# EAGLE schematic Addon-mapleCUx_Raspi-3V3-UART-CC2530-V04-006 (EAGLE 9.3.0)
MAPLE-CUx Large Version
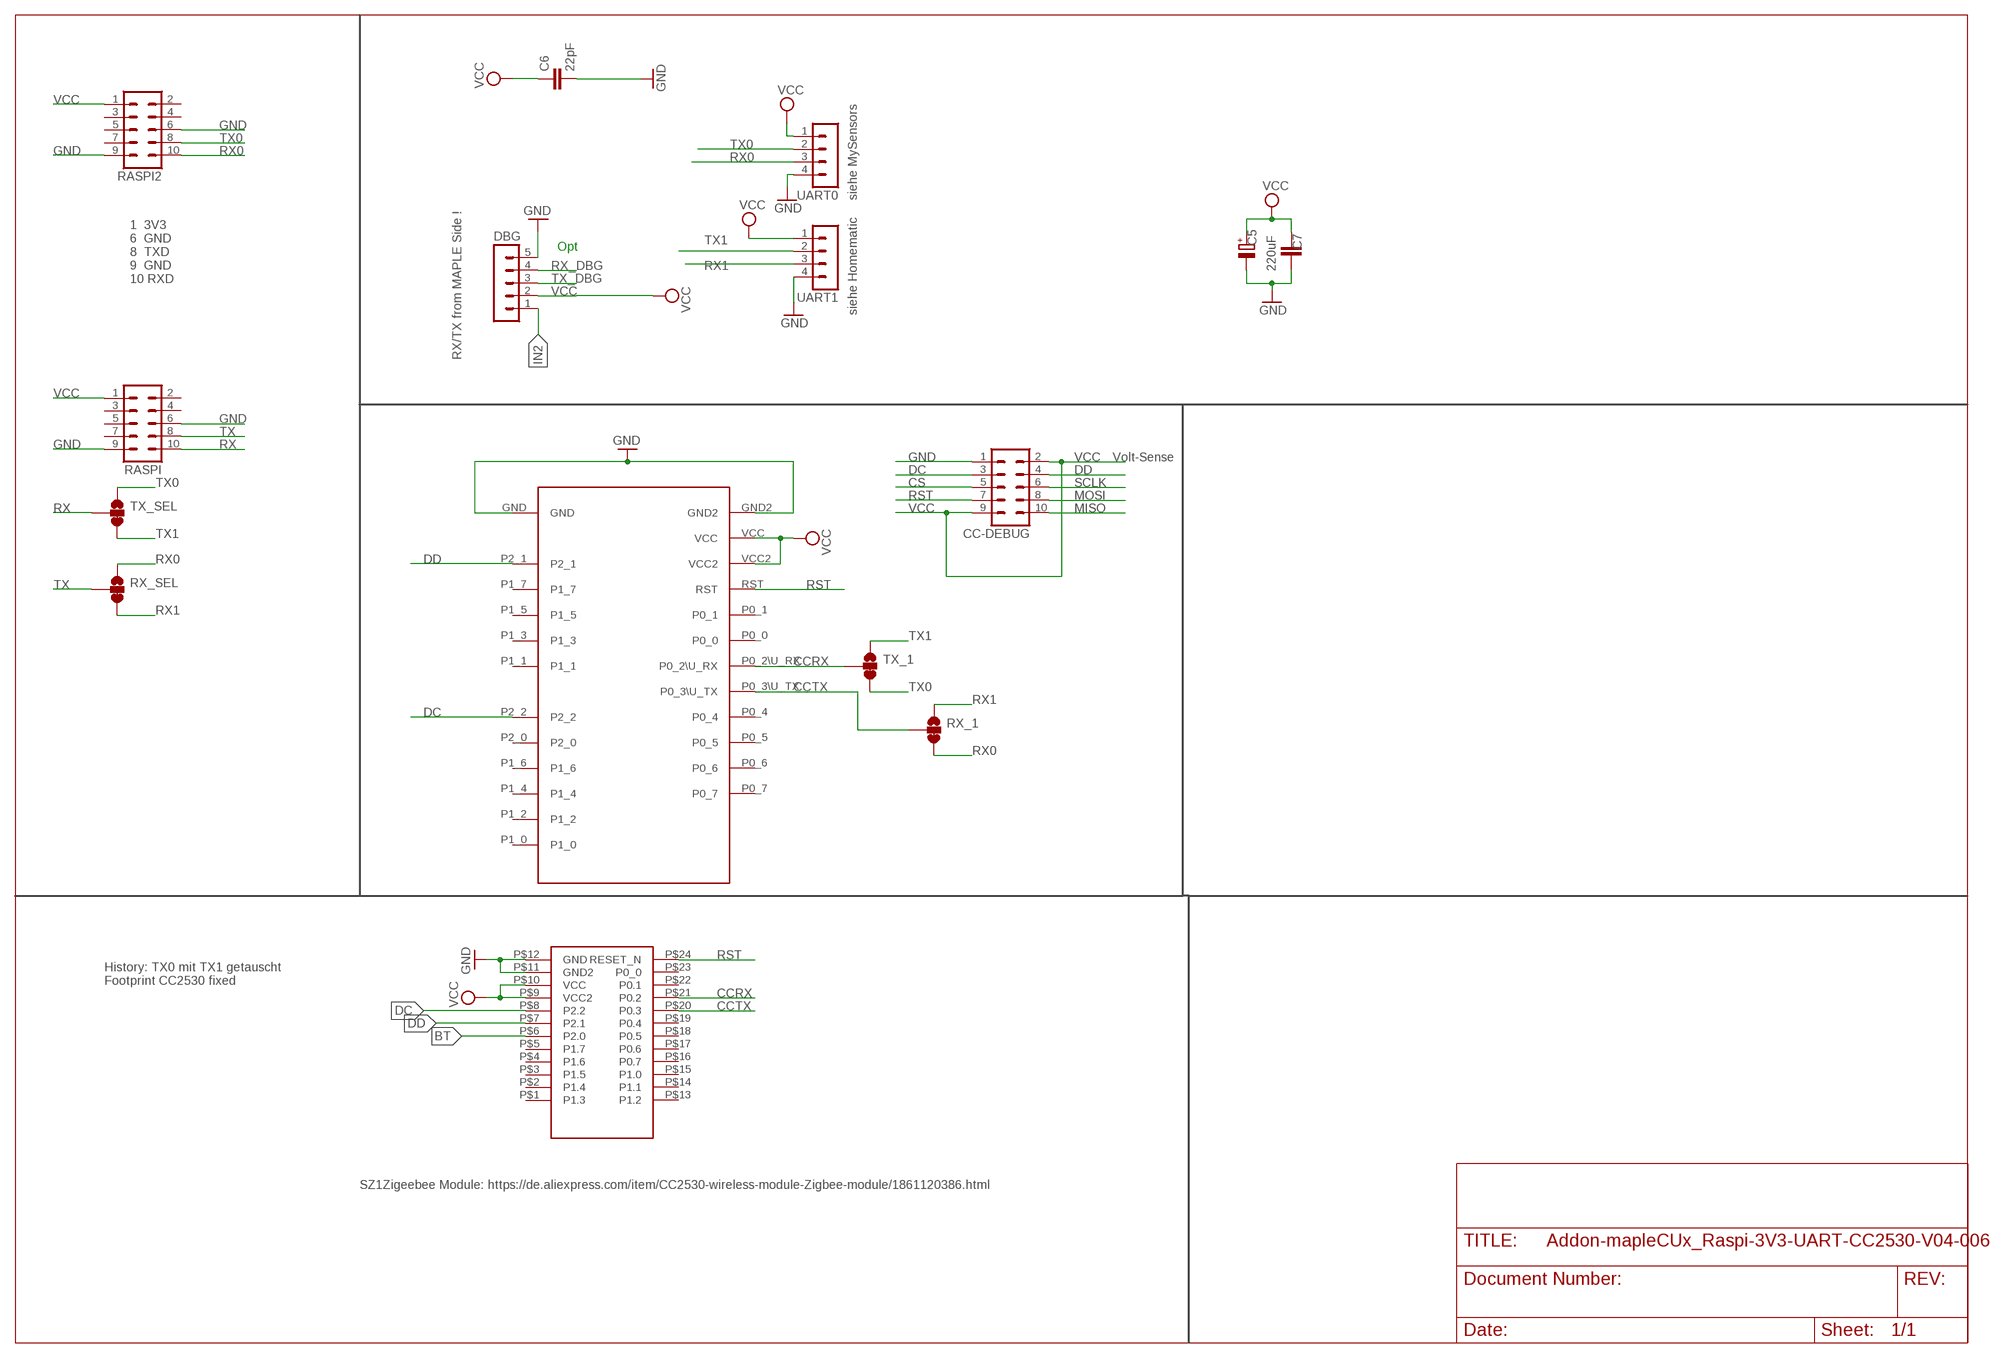
[diagram p0: schematic, sheet 1]

## Parts
C5  220uF  CPOL-EUE5-8.5  [E5-8,5]
C6  22pF  C-EUC0805  [C0805]
C7  C-EUC1812  [C1812]
CC-DEBUG  MA05-2  [MA05-2]
DBG  MA05-1  [MA05-1]
RASPI  MA05-2  [MA05-2]
RASPI2  MA05-2  [MA05-2]
RX_1  JUMPER-SMT_3_1-NC_TRACE_SILK  [SMT-JUMPER_3_1-NC_TRACE_SILK]
RX_SEL  JUMPER-SMT_3_1-NC_TRACE_SILK  [SMT-JUMPER_3_1-NC_TRACE_SILK]
TX_1  JUMPER-SMT_3_1-NC_TRACE_SILK  [SMT-JUMPER_3_1-NC_TRACE_SILK]
TX_SEL  JUMPER-SMT_3_1-NC_TRACE_SILK  [SMT-JUMPER_3_1-NC_TRACE_SILK]
U$1  CC2530CC2530PA  [CC2530PA]
U$3  CC2530_MODULE  [CC2530_DIL]
UART0  MA04-1  [MA04-1]
UART1  MA04-1  [MA04-1]

## Nets
BT: U$1.P$6(P2.0)
CCRX: TX_1.2 U$1.P$21(P0.2) U$3.P0_2\U_RX
CCTX: RX_1.2 U$1.P$20(P0.3) U$3.P0_3\U_TX
CS: CC-DEBUG.5
DC: CC-DEBUG.3 U$1.P$8(P2.2) U$3.P2_2
DD: CC-DEBUG.4 U$1.P$7(P2.1) U$3.P2_1
GND [PWR]: C5.- C6.2 C7.1 CC-DEBUG.1 DBG.5 RASPI2.6 RASPI2.9 RASPI.6 RASPI.9 U$1.P$11(GND2) U$1.P$12(GND) U$3.GND U$3.GND2 UART0.4 UART1.4
IN2 [PWR]: DBG.1
MISO: CC-DEBUG.10
MOSI: CC-DEBUG.8
RST: CC-DEBUG.7 U$1.P$24(RESET_N) U$3.RST
RX: RASPI.10 TX_SEL.2
RX0: RASPI2.10 RX_1.3 RX_SEL.1 UART0.3
RX1: RX_1.1 RX_SEL.3 UART1.3
RX_DBG: DBG.4
SCLK: CC-DEBUG.6
TX: RASPI.8 RX_SEL.2
TX0: RASPI2.8 TX_1.3 TX_SEL.1 UART0.2
TX1: TX_1.1 TX_SEL.3 UART1.2
TX_DBG: DBG.3
VCC [PWR]: C5.+ C6.1 C7.2 CC-DEBUG.2 CC-DEBUG.9 DBG.2 RASPI2.1 RASPI.1 U$1.P$9(VCC2) U$1.P$10(VCC) U$3.VCC U$3.VCC2 UART0.1 UART1.1
Unconnected: RASPI2.2 RASPI2.3 RASPI2.4 RASPI2.5 RASPI2.7 RASPI.2 RASPI.3 RASPI.4 RASPI.5 RASPI.7 U$1.P$1(P1.3) U$1.P$2(P1.4) U$1.P$3(P1.5) U$1.P$4(P1.6) U$1.P$5(P1.7) U$1.P$13(P1.2) U$1.P$14(P1.1) U$1.P$15(P1.0) U$1.P$16(P0.7) U$1.P$17(P0.6) U$1.P$18(P0.5) U$1.P$19(P0.4) U$1.P$22(P0.1) U$1.P$23(P0_0) U$3.P0_0 U$3.P0_1 U$3.P0_4 U$3.P0_5 U$3.P0_6 U$3.P0_7 U$3.P1_0 U$3.P1_1 U$3.P1_2 U$3.P1_3 U$3.P1_4 U$3.P1_5 U$3.P1_6 U$3.P1_7 U$3.P2_0

## Notes on the sheet
- siehe MySensors
- Opt
- 1  3V3
  6  GND
  8  TXD
  9  GND
  10 RXD
- siehe Homematic
- RX/TX from MAPLE Side !
- Volt-Sense
- History: TX0 mit TX1 getauscht
  Footprint CC2530 fixed
- SZ1Zigeebee Module: https://de.aliexpress.com/item/CC2530-wireless-module-Zigbee-module/1861120386.html

## Library data of the parts
C5 = rcl:CPOL-EU: POLARIZED CAPACITOR, European symbol; SPICEPREFIX: C
C6 C7 = rcl:C-EU: CAPACITOR, European symbol; SPICEPREFIX: C
CC-DEBUG RASPI RASPI2 = con-lstb:MA05-2: PIN HEADER; OC_FARNELL: unknown; OC_NEWARK: unknown
DBG = con-lstb:MA05-1: PIN HEADER; OC_FARNELL: unknown; OC_NEWARK: unknown
RX_1 RX_SEL TX_1 TX_SEL = SparkFun-Jumpers:JUMPER-SMT_3_1-NC_TRACE: Normally closed trace jumper (1 of 2 connections) This jumper has a trace between two pads so it's normally closed (NC). The other connection is normally open (NO). Use a razor knife to open the connection. For best results follow the IPC guidelines for cutting traces: Cutout at least 0.063 mm (0.005 in). Remove all loose material to clean up the cut area. Seal the cut with an approved epoxy. Reapply solder to reclose the connection, or to close the NO connection.
U$1 = zigbee:CC2530: CC2530 Wireless Zigbee Module 3.0-3.6V 2.405-2.485GHz
U$3 = Martin-Communication-V4:CC2530_MODULE
UART0 UART1 = con-lstb:MA04-1: PIN HEADER; OC_FARNELL: unknown; OC_NEWARK: unknown

## Net classes
0 default: width 0.305 mm
1 PWR: width 0.61 mm